# Altium schematic sheet Carama.SchDoc
size A3; SheetNumber: 6; SheetTotal: 7
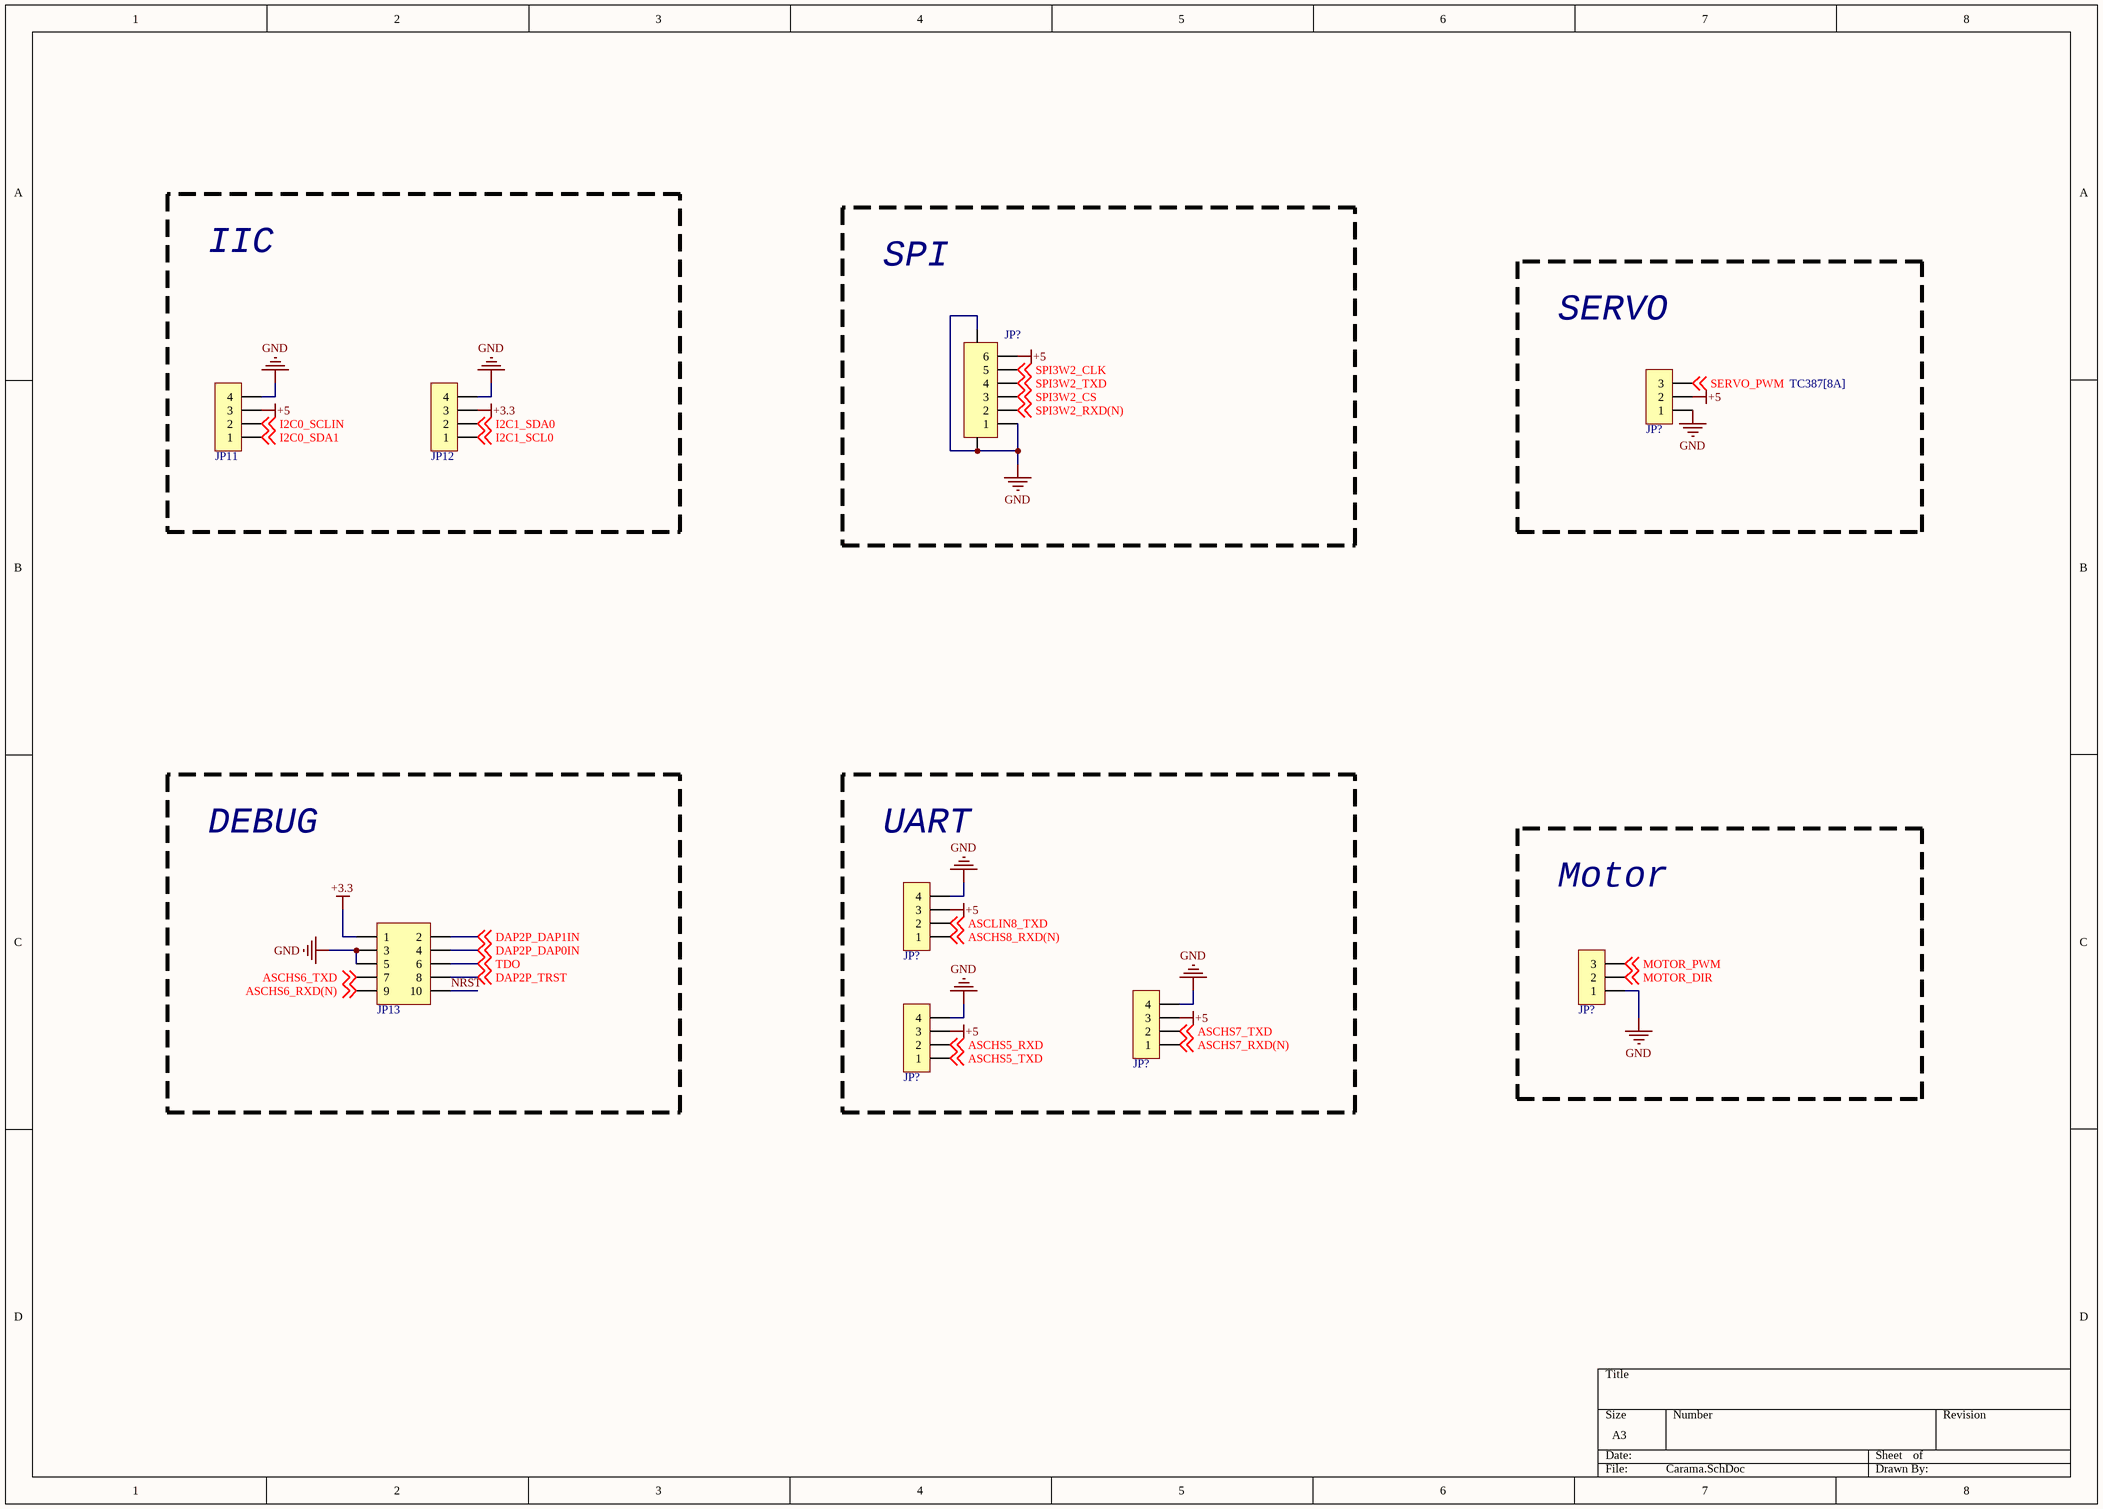
[diagram p0: Carama.SchDoc]

## Parts
(Parts that share a designator on the sheet are numbered #1, #2 ... from top to bottom, then left to right.)
JP11  HDR-1X4  [GH1.25-WT-4P]  (value not drawn)
JP12  HDR-1X4  [GH1.25-WT-4P]  (value not drawn)
JP13  Header 5X2  [HDR2.54-LI-2x5P]  (value not drawn)
JP?#1  HDR-1X3  [HDR2.54-LI-3P]  (value not drawn)
JP?#2  CON-6P  [SH1.0-WT-6P]  (value not drawn)
JP?#3  HDR-1X4  [GH1.25-WT-4P]  (value not drawn)
JP?#4  HDR-1X3  [GH1.25-LT-3P]  (value not drawn)
JP?#5  HDR-1X4  [GH1.25-WT-4P]  (value not drawn)
JP?#6  HDR-1X4  [GH1.25-WT-4P]  (value not drawn)

## Blocks framed on the sheet
IIC: JP11 JP12
SPI: JP?#2
SERVO: JP?#1
DEBUG: JP13
UART: JP?#3 JP?#5 JP?#6
Motor: JP?#4

## Nets
+3.3: JP12.3 JP13.1
+5: JP11.3 JP?#1.2 JP?#2.6 JP?#3.3 JP?#5.3 JP?#6.3
GND: JP11.4 JP12.4 JP13.3 JP13.5 JP?#1.1 JP?#2.0 JP?#2.1 JP?#3.4 JP?#4.1 JP?#5.4 JP?#6.4
ASCHS5_RXD: JP?#6.2 ; off-sheet ASCHS5_RXD
ASCHS5_TXD: JP?#6.1 ; off-sheet ASCHS5_TXD
ASCHS6_RXD(N): JP13.9 ; off-sheet ASCHS6_RXD(N)
ASCHS6_TXD: JP13.7 ; off-sheet ASCHS6_TXD
ASCHS7_RXD(N): JP?#5.1 ; off-sheet ASCHS7_RXD(N)
ASCHS7_TXD: JP?#5.2 ; off-sheet ASCHS7_TXD
ASCHS8_RXD(N): JP?#3.1 ; off-sheet ASCHS8_RXD(N)
ASCLIN8_TXD: JP?#3.2 ; off-sheet ASCLIN8_TXD
DAP2P_DAP0IN: JP13.4 ; off-sheet DAP2P_DAP0IN
DAP2P_DAP1IN: JP13.2 ; off-sheet DAP2P_DAP1IN
DAP2P_TRST: JP13.8 ; off-sheet DAP2P_TRST
I2C0_SCLIN: JP11.2 ; off-sheet I2C0_SCLIN
I2C0_SDA1: JP11.1 ; off-sheet I2C0_SDA1
I2C1_SCL0: JP12.1 ; off-sheet I2C1_SCL0
I2C1_SDA0: JP12.2 ; off-sheet I2C1_SDA0
MOTOR_DIR: JP?#4.2 ; off-sheet MOTOR_DIR
MOTOR_PWM: JP?#4.3 ; off-sheet MOTOR_PWM
NRST: JP13.10
SERVO_PWM: JP?#1.3 ; off-sheet SERVO_PWM
SPI3W2_CLK: JP?#2.5 ; off-sheet SPI3W2_CLK
SPI3W2_CS: JP?#2.3 ; off-sheet SPI3W2_CS
SPI3W2_RXD(N): JP?#2.2 ; off-sheet SPI3W2_RXD(N)
SPI3W2_TXD: JP?#2.4 ; off-sheet SPI3W2_TXD
TDO: JP13.6 ; off-sheet TDO

## Library data of the parts
JP11 JP12 JP?#3 JP?#5 JP?#6 = Header 4: 4P连接器; 联系卖家 免费技术支持: 封装库来自淘宝卖家ID：黄晶宝石; BOM名称: 4P连接器
JP13 = Header 5X2: 5*2P接插件; 联系卖家，免费查找封装: 唯一出售店铺网址https://shop463601444.taobao.com; 封装库来自淘宝卖家ID：黄晶宝石: 其他店铺购入均为盗版封装库，请立即申请退款，本店现金奖励50~200元; BOM名称: 5*2P接插件
JP?#1 = Header 3: 3P接插件; 联系卖家，免费查找封装: 唯一出售店铺网址https://shop463601444.taobao.com; 封装库来自淘宝卖家ID：黄晶宝石: 其他店铺购入均为盗版封装库，请立即申请退款，本店现金奖励50~200元; BOM名称: 3P接插件
JP?#2 = Header 6: 6P连接器; 封装库来自淘宝卖家：黄晶宝石: 获取最新版本https://shop463601444.taobao.com; BOM名称: 6P连接器
JP?#4 = Header 3: 3P连接器; 联系卖家 免费技术支持: 封装库来自淘宝卖家ID：黄晶宝石; BOM名称: 3P连接器